# Altium schematic sheet ALCT2017_Logic.SchDoc: Overview
size B; Organization: UCLA High Energy Physics; DocumentNumber: 1; Revision: 2.0; SheetNumber: 1; SheetTotal: 12; CurrentDate: 8/7/2018; DocumentName: Overview; ModifiedDate: 8/20/2018; ProjectName: ALCT S-6 Optical Mezzanine
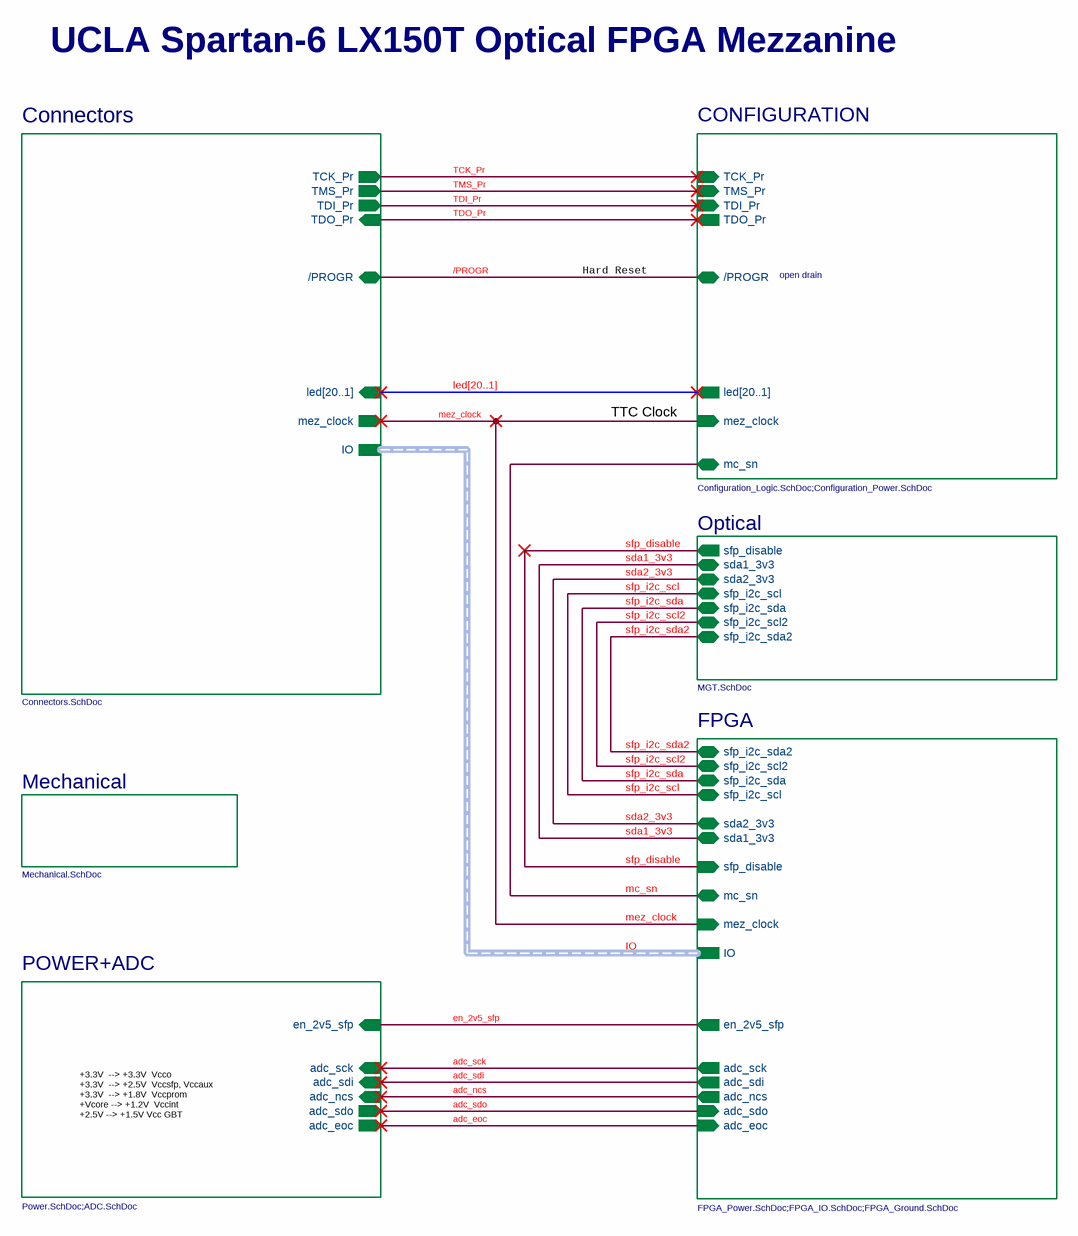
[diagram p0: ALCT2017_Logic.SchDoc]

## Sub-sheets
CONFIGURATION = Configuration_Logic.SchDoc;Configuration_Power.SchDoc: TCK_Pr (in), /PROGR (bidir), TDO_Pr (out), TDI_Pr (in), TMS_Pr (in), mc_sn (bidir), mez_clock (in), led[20..1] (out)
Connectors = Connectors.SchDoc: TCK_Pr (out), TMS_Pr (out), TDI_Pr (out), TDO_Pr (in), /PROGR (bidir), mez_clock (out), IO (harness Samtec IO), led[20..1] (in)
FPGA = FPGA_Power.SchDoc;FPGA_IO.SchDoc;FPGA_Ground.SchDoc: mez_clock (in), adc_sck (out), adc_sdi (out), adc_ncs (out), adc_sdo (in), adc_eoc (in), IO (harness Samtec IO), mc_sn (bidir), sfp_i2c_sda2 (bidir), sfp_i2c_sda (bidir), sfp_i2c_scl (bidir), sfp_i2c_scl2 (bidir), sfp_disable (in), sda2_3v3 (bidir), sda1_3v3 (bidir), en_2v5_sfp (out)
Mechanical = Mechanical.SchDoc: no entries
Optical = MGT.SchDoc: sfp_i2c_sda2 (bidir), sfp_i2c_sda (bidir), sfp_i2c_scl (bidir), sfp_i2c_scl2 (bidir), sfp_disable (out), sda2_3v3 (bidir), sda1_3v3 (bidir)
POWER+ADC = Power.SchDoc;ADC.SchDoc: adc_sdo (out), adc_eoc (out), adc_sck (in), adc_sdi (in), adc_ncs (in), en_2v5_sfp (in)

## Nets
/PROGR: sheet Connectors//PROGR, sheet CONFIGURATION//PROGR
adc_eoc: sheet FPGA/adc_eoc, sheet POWER+ADC/adc_eoc
adc_ncs: sheet FPGA/adc_ncs, sheet POWER+ADC/adc_ncs
adc_sck: sheet FPGA/adc_sck, sheet POWER+ADC/adc_sck
adc_sdi: sheet FPGA/adc_sdi, sheet POWER+ADC/adc_sdi
adc_sdo: sheet FPGA/adc_sdo, sheet POWER+ADC/adc_sdo
en_2v5_sfp: sheet FPGA/en_2v5_sfp, sheet POWER+ADC/en_2v5_sfp
mc_sn: sheet CONFIGURATION/mc_sn, sheet FPGA/mc_sn
mez_clock: sheet Connectors/mez_clock, sheet CONFIGURATION/mez_clock, sheet FPGA/mez_clock
sda1_3v3: sheet Optical/sda1_3v3, sheet FPGA/sda1_3v3
sda2_3v3: sheet Optical/sda2_3v3, sheet FPGA/sda2_3v3
sfp_disable: sheet Optical/sfp_disable, sheet FPGA/sfp_disable
sfp_i2c_scl: sheet Optical/sfp_i2c_scl, sheet FPGA/sfp_i2c_scl
sfp_i2c_scl2: sheet Optical/sfp_i2c_scl2, sheet FPGA/sfp_i2c_scl2
sfp_i2c_sda: sheet Optical/sfp_i2c_sda, sheet FPGA/sfp_i2c_sda
sfp_i2c_sda2: sheet Optical/sfp_i2c_sda2, sheet FPGA/sfp_i2c_sda2
TCK_Pr: sheet Connectors/TCK_Pr, sheet CONFIGURATION/TCK_Pr
TDI_Pr: sheet Connectors/TDI_Pr, sheet CONFIGURATION/TDI_Pr
TDO_Pr: sheet Connectors/TDO_Pr, sheet CONFIGURATION/TDO_Pr
TMS_Pr: sheet Connectors/TMS_Pr, sheet CONFIGURATION/TMS_Pr

## Buses and harness runs
bus led[20..1] = sheet CONFIGURATION/led[20..1] = sheet Connectors/led[20..1]
harness IO = sheet Connectors/IO = sheet FPGA/IO

## Notes on the sheet
- UCLA Spartan-6 LX150T Optical FPGA Mezzanine
- Hard Reset
- open drain
- TTC Clock
- +3.3V  --> +3.3V  Vcco
  +3.3V  --> +2.5V  Vccsfp, Vccaux
  +3.3V  --> +1.8V  Vccprom
  +Vcore --> +1.2V  Vccint
  +2.5V --> +1.5V Vcc GBT
- Date:
- Rev:
- of
- Sheet